# EAGLE design LoRa_Dev_A.1 (EAGLE 9.1.0)
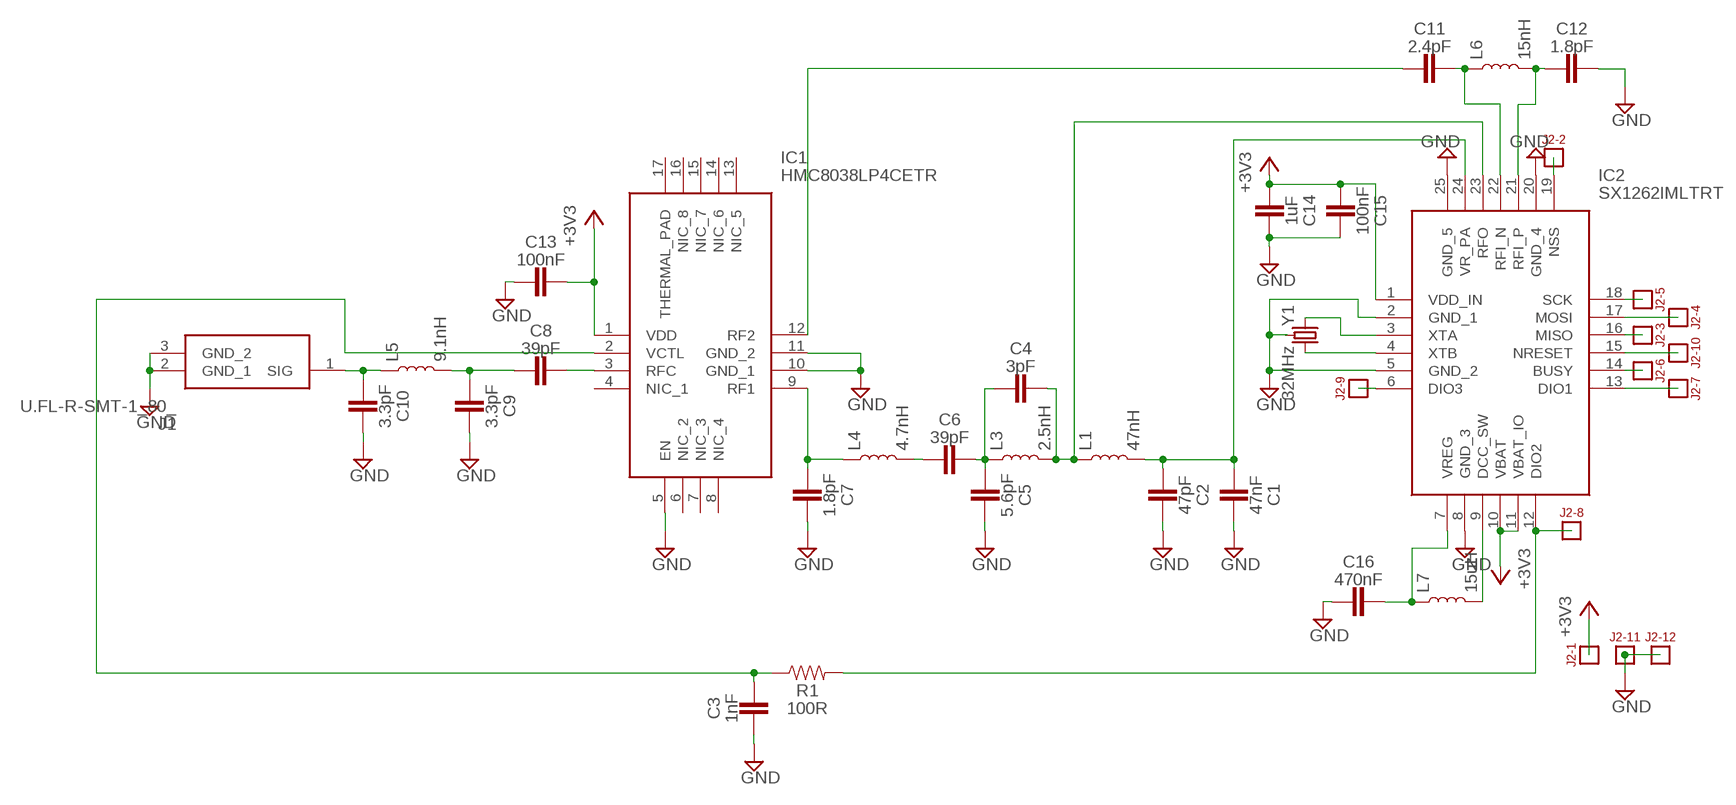
[diagram p0: schematic, sheet 1]

## Parts
C1  47nF  C_0603  [0603]
C2  47pF  C_0603  [0603]
C3  1nF  C_0603  [0603]
C4  3pF  C_0603  [0603]
C5  5.6pF  C_0402  [0402]
C6  39pF  C_0402  [0402]
C7  1.8pF  C_0402  [0402]
C8  39pF  C_0402  [0402]
C9  3.3pF  C_0402  [0402]
C10  3.3pF  C_0402  [0402]
C11  2.4pF  C_0402  [0402]
C12  1.8pF  C_0402  [0402]
C13  100nF  C_0402  [0402]
C14  1uF  C_0402  [0402]
C15  100nF  C_0402  [0402]
C16  470nF  C_0402  [0402]
IC1  HMC8038LP4CETR  [QFN65P400X400X90-17N]
IC2  SX1262IMLTRT  [QFN50P400X400X100-25N]
J1  U.FL-R-SMT-1_80_  [UFLRSMT180]
J2  HEADER_12PIN  [HEADER_12PIN]
L1  47nH  L_0603  [0603]
L3  2.5nH  L_0402  [0402]
L4  4.7nH  L_0402  [0402]
L5  9.1nH  L_0402  [0402]
L6  15nH  L_0402  [0402]
L7  15uH  L_0805  [0805]
R1  100R  R_0402  [0402]
Y1  32MHz  XTAL_SMD2016-4P  [SMD2016-4P]

## Nets
+3V3: C13.2 C14.1 C15.1 IC1.1(VDD) IC2.1(VDD_IN) IC2.10(VBAT) IC2.11(VBAT_IO) J2.P$1
BUSY: IC2.14(BUSY) J2.P$6
DCC_SW: IC2.9(DCC_SW) L7.2
DIO1: IC2.13(DIO1) J2.P$7
DIO2: IC2.12(DIO2) J2.P$8 R1.2
DIO3: IC2.6(DIO3) J2.P$9
GND: C1.2 C2.2 C3.1 C5.2 C7.2 C9.2 C10.2 C12.2 C13.1 C14.2 C15.2 C16.1 IC1.5(EN) IC1.10(GND_1) IC1.11(GND_2) IC2.2(GND_1) IC2.5(GND_2) IC2.8(GND_3) IC2.20(GND_4) IC2.25(GND_5) J1.2(GND_1) J1.3(GND_2) J2.P$11 J2.P$12 Y1.2 Y1.4
MISO: IC2.16(MISO) J2.P$3
MOSI: IC2.17(MOSI) J2.P$4
N$1: C10.1 J1.1(SIG) L5.1
N$2: C8.1 C9.1 L5.2
N$3: C8.2 IC1.3(RFC)
N$4: C3.2 IC1.2(VCTL) R1.1
N$8: C11.1 IC1.12(RF2)
N$9: C7.1 IC1.9(RF1) L4.1
N$10: C6.1 L4.2
N$11: C4.1 C5.1 C6.2 L3.1
NRESET: IC2.15(NRESET) J2.P$10
NSS: IC2.19(NSS) J2.P$2
RFI_1: C11.2 IC2.22(RFI_N) L6.1
RFI_2: C12.1 IC2.21(RFI_P) L6.2
RFO: C4.2 IC2.23(RFO) L1.1 L3.2
SCK: IC2.18(SCK) J2.P$5
VR_PA: C1.1 C2.1 IC2.24(VR_PA) L1.2
VREG: C16.2 IC2.7(VREG) L7.1
XTA: IC2.3(XTA) Y1.1
XTB: IC2.4(XTB) Y1.3
Unconnected: IC1.4(NIC_1) IC1.6(NIC_2) IC1.7(NIC_3) IC1.8(NIC_4) IC1.13(NIC_5) IC1.14(NIC_6) IC1.15(NIC_7) IC1.16(NIC_8) IC1.17(THERMAL_PAD)

## Library data of the parts
C1-C4 = NSE LABS:C_0603
C5-C16 = NSE LABS:C_0402: Samsung Source: Datasheet <https://datasheet.lcsc.com/szlcsc/Samsung-Electro-Mechanics-CL05B104KB54PNC_C307331.pdf>
IC1 = NSE LABS:HMC8038LP4CETR: RF Switch ICs High isolation, non-reflective, single s Source: Datasheet <https://pt.mouser.com/datasheet/2/609/HMC8038W-2956082.pdf>; ARROW_PART_NUMBER: HMC8038LP4CETR; ARROW_PRICE-STOCK: https://www.arrow.com/en/products/hmc8038lp4cetr/analog-devices?region=nac; DESCRIPTION: RF Switch ICs High isolation, non-reflective, single s; HEIGHT: 0.9mm; MANUFACTURER_NAME: Analog Devices; MANUFACTURER_PART_NUMBER: HMC8038LP4CETR; MOUSER_PART_NUMBER: 584-HMC8038LP4CETR; MOUSER_PRICE-STOCK: https://www.mouser.co.uk/ProductDetail/Analog-Devices/HMC8038LP4CETR?qs=JeIcUl65ClBZnat%2FltI6ww%3D%3D
IC2 = NSE LABS:SX1262IMLTRT: RF Transceiver LoRa, sub-GHz RF Transceiver 22dBm PA Source: Datasheet <http://www.mouser.com/datasheet/2/761/DS_SX1261-2_V1.1-1307803.pdf>; ARROW_PART_NUMBER: SX1262IMLTRT; ARROW_PRICE-STOCK: https://www.arrow.com/en/products/sx1262imltrt/semtech?region=nac; DESCRIPTION: RF Transceiver LoRa, sub-GHz RF Transceiver 22dBm PA; HEIGHT: 1mm; MANUFACTURER_NAME: SEMTECH; MANUFACTURER_PART_NUMBER: SX1262IMLTRT; MOUSER_PART_NUMBER: 947-SX1262IMLTRT; MOUSER_PRICE-STOCK: https://www.mouser.co.uk/ProductDetail/Semtech/SX1262IMLTRT?qs=XFmntM7Yc9eYt6yxTPughQ%3D%3D
J1 = NSE LABS:U.FL-R-SMT-1_80_: RF Connectors/Coaxial Connectors SMD RoHS Source: Datasheet <https://www.hirose.com/product/download/?distributor=digikey&type=2d&lang=en&num=U.FL-R-SMT-1(80)>; DESCRIPTION: RF Connectors/Coaxial Connectors SMD RoHS; HEIGHT: 1.45mm; MANUFACTURER_NAME: Hirose; MANUFACTURER_PART_NUMBER: U.FL-R-SMT-1(80); MOUSER_PART_NUMBER: 798-UFLRSMT180; MOUSER_PRICE-STOCK: https://www.mouser.co.uk/ProductDetail/Hirose-Connector/U.FL-R-SMT-180?qs=PABxe4V6HDqFClp15N8Kig%3D%3D
J2 = NSE LABS:HEADER_12PIN
L1 = NSE LABS:L_0603
L3-L6 = NSE LABS:L_0402
L7 = NSE LABS:L_0805
R1 = NSE LABS:R_0402
Y1 = NSE LABS:XTAL_SMD2016-4P

## Board
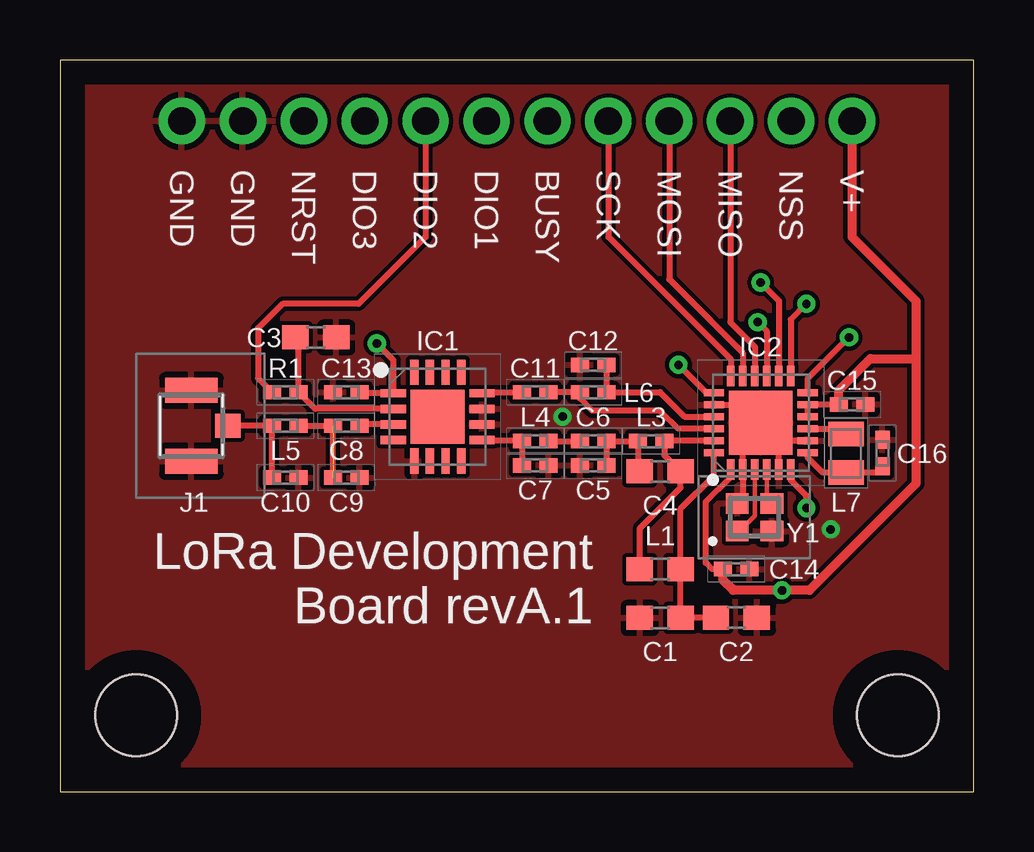
[diagram p1: board, top side]
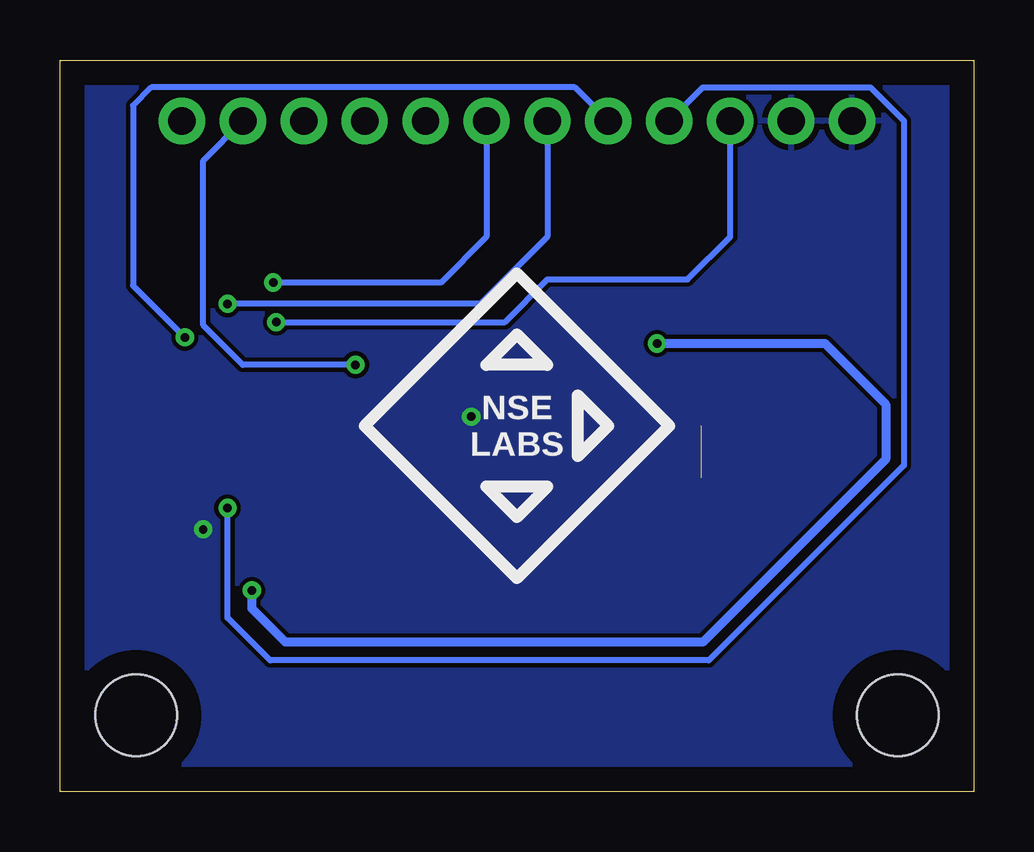
[diagram p2: board, bottom side, seen from below]

Size 38.1 x 30.48 mm. Coordinates in mm from the lower left corner, seen from the top.
Outline: 0,0 38.1,0 38.1,30.48 0,30.48 0,0
Copper layers (1*16): Top 0.035mm / dielectric 1.5mm / Bottom 0.035mm
Design rules "default": minimum track width 6mil, minimum drill 0.35mm, track to track 6mil, track to pad 6mil, pad to pad 6mil, via to via 6mil, smd to smd 6mil, copper to edge 40mil, drill to drill 6mil, minimum pad ring 10mil, minimum via ring 8mil, stop-mask expansion 4mil, vias tented up to drill 0mil, thermal gap 10mil
Holes 3.4 mm at 3.17,3.17 34.92,3.17

### Footprints (pad centres in the part's own frame; a part is rotated, then mirrored left to right if it is on the bottom)
0603 = smd 1.1 x 1: 1 -0.85,0; 2 0.85,0
0402 = smd 0.75 x 0.6: 1 -0.55,0; 2 0.55,0
QFN65P400X400X90-17N = smd 1.05 x 0.35: 1 -1.85,0.975; 2 -1.85,0.325; 3 -1.85,-0.325; 4 -1.85,-0.975; 9 1.85,-0.975; 10 1.85,-0.325; 11 1.85,0.325; 12 1.85,0.975 | smd 0.35 x 1.05: 5 -0.975,-1.85; 6 -0.325,-1.85; 7 0.325,-1.85; 8 0.975,-1.85; 13 0.975,1.85; 14 0.325,1.85; 15 -0.325,1.85; 16 -0.975,1.85 | smd 2.25 x 2.25: 17 0,0
QFN50P400X400X100-25N = smd 0.85 x 0.3: 1 -1.95,1.25; 2 -1.95,0.75; 3 -1.95,0.25; 4 -1.95,-0.25; 5 -1.95,-0.75; 6 -1.95,-1.25; 13 1.95,-1.25; 14 1.95,-0.75; 15 1.95,-0.25; 16 1.95,0.25; 17 1.95,0.75; 18 1.95,1.25 | smd 0.3 x 0.85: 7 -1.25,-1.95; 8 -0.75,-1.95; 9 -0.25,-1.95; 10 0.25,-1.95; 11 0.75,-1.95; 12 1.25,-1.95; 19 1.25,1.95; 20 0.75,1.95; 21 0.25,1.95; 22 -0.25,1.95; 23 -0.75,1.95; 24 -1.25,1.95 | smd 2.65 x 2.65: 25 0,0
UFLRSMT180 = smd 1 x 1.05: 1 0,-1.413 | smd 1.05 x 2.2: 2 -1.475,0.112; 3 1.475,0.112
HEADER_12PIN = drill 1.143 pad 1.93: P$1 -13.97,0; P$2 -11.43,0; P$3 -8.89,0; P$4 -6.35,0; P$5 -3.81,0; P$6 -1.27,0; P$7 1.27,0; P$8 3.81,0; P$9 6.35,0; P$10 8.89,0; P$11 11.43,0; P$12 13.97,0
0805 = smd 1.02 x 1.47: 1 -0.8,0; 2 0.8,0
SMD2016-4P = smd 0.95 x 0.85: 1 -0.725,-0.575; 2 0.725,-0.575; 3 0.725,0.575; 4 -0.725,0.575

### Placement (x,y rotation side)
C1  25.02,7.24 180 top
C2  28.19,7.24 0 top
C3  10.67,18.92 180 top
C4  25.02,13.34 0 top
C5  22.23,13.59 180 top
C6  22.23,14.61 0 top
C7  19.81,13.59 0 top
C8  11.94,15.24 0 top
C9  11.94,13.08 0 top
C10  9.4,13.08 0 top
C11  19.81,16.64 0 top
C12  22.23,17.78 180 top
C13  11.94,16.64 0 top
C14  28.19,9.27 0 top
C15  33.02,16.13 0 top
C16  34.29,14.1 270 top
IC1  15.75,15.62 0 top
IC2  29.21,15.37 90 top
J1  5.59,15.24 90 top
J2  19.05,27.94 180 top
L1  25.02,9.27 0 top
L3  24.64,14.61 0 top
L4  19.81,14.61 0 top
L5  9.4,15.24 0 top
L6  22.23,16.64 0 top
L7  32.77,14.1 90 top
R1  9.4,16.64 180 top
Y1  28.96,11.43 0 top

### Tracks (layer width: path | path; a pad name or v marks a point on that pad's centre or on a via)
+3V3  (via drill 0.35)
  Top 0.178: C15.1 32.46,16.12
  Top 0.254: C13.2 12.57,16.6 IC1.1 13.9,17.98 v13.21,18.67 | 32.46,16.12 IC2.11 IC2.10 | C14.1 27.18,9.27 26.92,9.53 26.92,12.07 27.96,13.1 IC2.1
  Top 0.381: C14.1 27.64,8.8 28.07,8.38 v30.1,8.38 31.24,8.38 35.69,12.83 35.69,18.03 | 35.69,18.03 35.69,20.45 33.02,23.11 J2.P$1 | C15.1 32.47,16.72 33.78,18.03 35.69,18.03
  Bottom 0.381: v13.21,18.67 6.22,18.67 3.68,16.13 3.68,13.84 11.3,6.22 28.7,6.22 30.1,7.62 v30.1,8.38
BUSY  (via drill 0.35)
  Top 0.254: v29.21,21.21 29.97,20.45 29.97,17.33 IC2.14
  Bottom 0.254: v29.21,21.21 22.23,21.21 20.32,23.11 J2.P$6
DCC_SW
  Top 0.178: 32.55,15.12 L7.2
  Top 0.254: IC2.9 32.55,15.12
DIO1  (via drill 0.35)
  Top 0.254: v31.11,20.32 30.46,19.66 IC2.13
  Bottom 0.254: v31.11,20.32 20.57,20.32 17.78,23.11 J2.P$7
DIO2  (via drill 0.35)
  Top 0.254: IC2.12 31.16,17.19 v32.89,18.92 | R1.2 8.26,17.23 8.26,19.3 9.27,20.32 12.45,20.32 15.24,23.11 J2.P$8
  Bottom 0.254: J2.P$8 16.64,29.34 34.29,29.34 35.05,28.57 35.05,21.08 v32.89,18.92
DIO3  (via drill 0.35)
  Top 0.254: IC2.6 30.46,12.97 31.11,12.32 v31.11,11.81
  Bottom 0.254: J2.P$9 11.3,29.34 4.32,29.34 2.92,27.94 2.92,13.59 11.05,5.46 29.34,5.46 31.11,7.24 v31.11,11.81
GND  (via drill 0.35)
  Top 0.254: Y1.4 28.46,12.23 IC2.2 28.46,14.74 29.15,15.43 | IC2.5 29.96,14.62 | 29.96,14.62 IC2.25 29.15,15.43 | IC2.8 29.96,14.62 | IC2.20 28.46,16.12 29.15,15.43
  other vias: 32.13,10.92 20.95,15.62
  pour Top (isolate 0.178): 0,0 38.1,0 38.1,30.48 0,30.48
  pour Bottom (isolate 0.178): 0,0 38.1,0 38.1,30.48 0,30.48
MISO
  Top 0.254: IC2.16 28.96,18.54 27.94,19.56 J2.P$3
MOSI
  Top 0.254: IC2.17 28.46,18.28 25.4,21.34 J2.P$4
N$1
  Top 0.254: C10.1 L5.1 J1.1
N$2  (1 unrouted)
  Top 0.254: 10.2,15.24 L5.2 C8.1 C9.1
N$3
  Top 0.254: IC1.3 12.54,15.3 C8.2
N$4
  Top 0.254: IC1.2 10.64,15.95 R1.1 9.95,18.79 C3.2
N$8
  Top 0.254: IC1.12 17.64,16.64 C11.1
N$9
  Top 0.254: IC1.9 19.22,14.65 L4.1 C7.1
N$10
  Top 0.254: L4.2 C6.1
N$11
  Top 0.254: C5.1 C6.2 L3.1 24.09,13.42 C4.1
NRESET  (via drill 0.35)
  Top 0.254: v29.08,19.56 29.46,19.18 IC2.15
  Bottom 0.254: v29.08,19.56 19.56,19.56 17.78,21.34 11.94,21.34 10.16,23.11 J2.P$10
NSS  (via drill 0.35)
  Top 0.254: IC2.19 26.94,16.62 v25.78,17.78
  Bottom 0.254: v25.78,17.78 30.48,17.78 32.13,19.43 32.13,26.29 J2.P$2
RFI_1
  Top 0.254: C11.2 L6.1 21.68,16.38 22.18,15.88 25.02,15.88 25.78,15.12 IC2.22
RFI_2
  Top 0.254: C12.1 L6.2 25.02,16.64 26.04,15.62 IC2.21
RFO
  Top 0.254: IC2.23 L3.2 25.19,14.02 C4.2 25.87,12.66 24.17,10.96 L1.1
SCK
  Top 0.254: IC2.18 27.96,18.01 22.86,23.11 J2.P$5
VR_PA
  Top 0.254: IC2.24 27.26,13.16 25.87,11.77 L1.2 C1.1 C2.1
VREG
  Top 0.178: 34.04,13.3 C16.2
  Top 0.254: IC2.7 31.16,13.93 31.79,13.3 L7.1 34.04,13.3
XTA
  Top 0.178: IC2.3 28.96,11.49 28.32,10.86 Y1.1
XTB
  Top 0.178: 29.46,12.23 IC2.4
  Top 0.254: Y1.3 29.46,12.23

### Text on the board
tPlace: GND | GND | NRST | DIO3 | DIO2 | DIO1 | BUSY | SCK | MOSI | MISO | NSS | V+ | LoRa Development / Board revA.1
bPlace: NSE / LABS